# Altium schematic sheet FM Trap.SchDoc
size A4; SheetNumber: 1; SheetTotal: 1
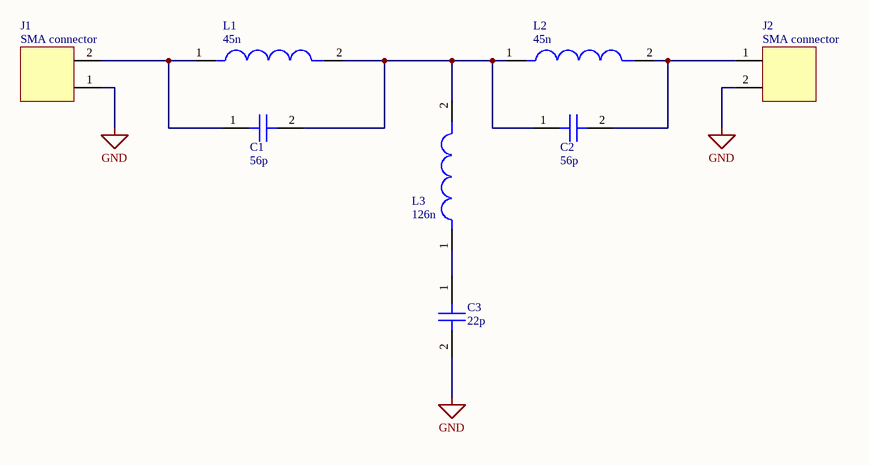
[diagram p0: FM Trap.SchDoc]

## Parts
C1  56p  [0603_CAP]
C2  56p  [0603_CAP]
C3  22p  [0603_CAP]
J1  SMA connector
J2  SMA connector
L1  45n  [0603_CAP]
L2  45n  [0603_CAP]
L3  126n  [0603_CAP]

## Nets
GND: C3.2 J1.1 J2.2
NetC1_1: C1.1 J1.2 L1.1
NetC1_2: C1.2 C2.1 L1.2 L2.1 L3.2
NetC2_2: C2.2 J2.1 L2.2
NetC3_1: C3.1 L3.1

## Library data of the parts
C1-C3 = CAP_0603_generic: Part Number: *; Manufacturer: *; Supplier: *; Order Code: *
  C1 C2: Value: 56p
  C3: Value: 22p
J1 J2 = HEADER_1x2_0.254MM: Part Number: *; Value: SMA connector; Manufacturer: *; Supplier: *; Order Code: *
L1-L3 = IND_air_0603_generic: Part Number: *; Manufacturer: *; Supplier: *; Order Code: *
  L1 L2: Value: 45n
  L3: Value: 126n